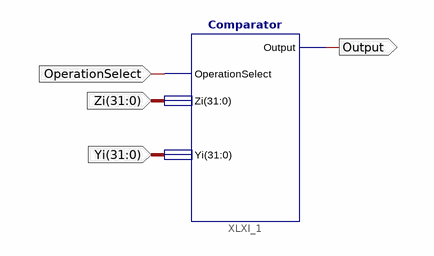
[diagram p0: schematic sheet 1]
// Xilinx ISE schematic comparatorSchematic.sch (spartan3e) as structural Verilog: 1 symbols, 4 ports
module comparatorSchematic (
  input  OperationSelect,
  input  [31:0] Zi,
  input  [31:0] Yi,
  output Output
);

  Comparator XLXI_1 (.OperationSelect(OperationSelect), .Zi(Zi), .Yi(Yi), .Output(Output));
endmodule
